# EAGLE design 2DD-20-mk-2.0.0 (EAGLE 7.5.0)
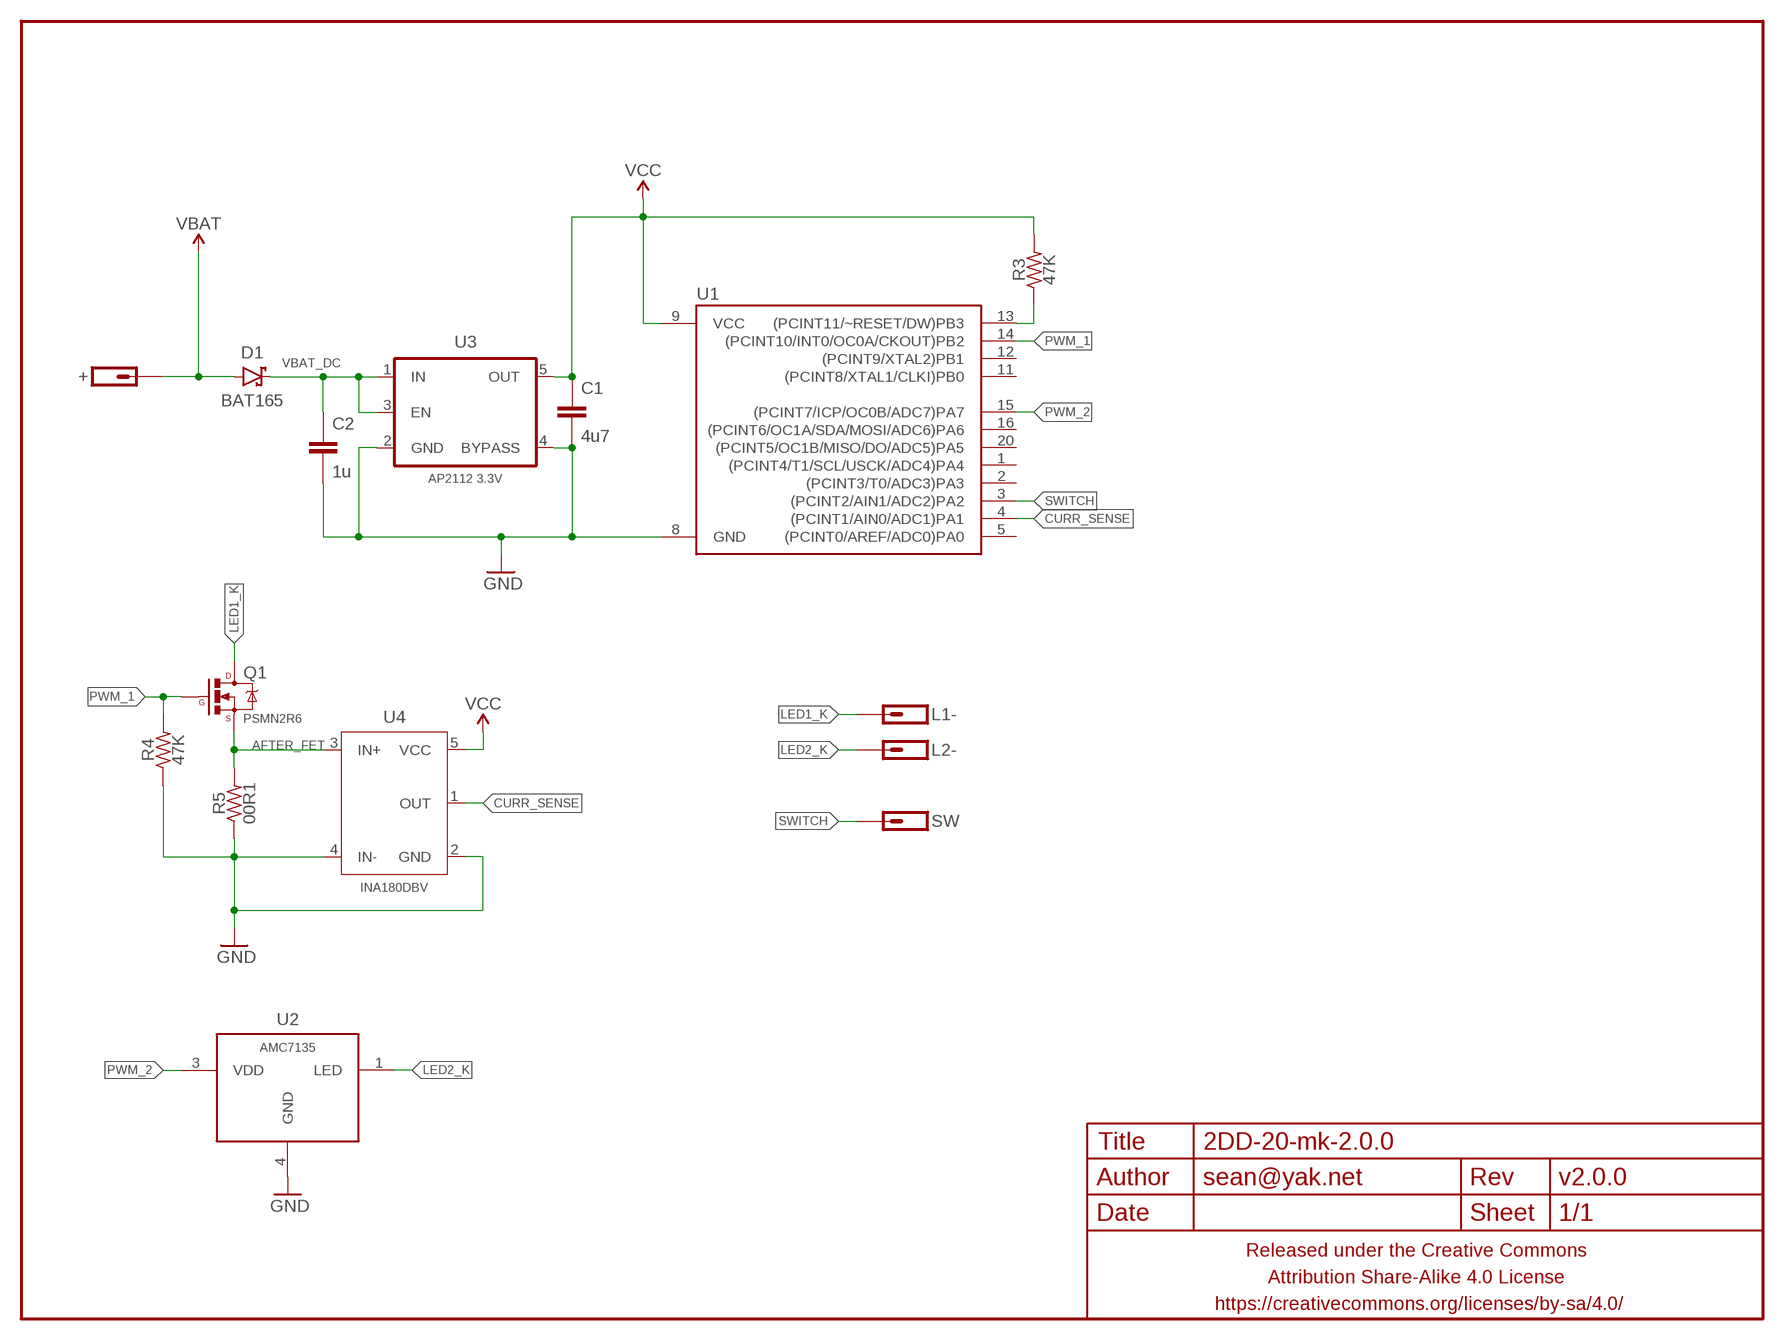
[diagram p0: schematic, sheet 1]

## Parts
+  M01PTH-1MM-CIR-NS  [1X01-1MM-CIR-NS]
C1  4u7  CAPACITOR-CERAMICC0603-TIGHTER  [C0603-TIGHTER]
C2  1u  CAPACITOR-CERAMICC0402  [C0402]
D1  BAT165  DIODE-SCHOTTKYSOD323  [SOD323-SCHOTTKY]
FRAME1  FRAME-LETTERNO_PACKAGE  [DUMMY]
L1-  M011X01-0.9MM-CIR  [1X01-0.9MM-CIR]
L2-  M01PTH-0.8MM-CIR  [1X01-0.8MM-CIR]
Q1  PSMN2R6  MOSFET-NCHANNELSIR800DP  [POWERPACK-SO-8]
R3  47K  RESISTORR0402  [R0402]
R4  47K  RESISTORR0402  [R0402]
R5  00R1  RESISTORR1206  [R1206]
SW  M01SMD-0.8MM-DIA-NS  [1X01-SMD-0.8MM-DIA-NS]
U1  ATTINY84ATTINY84-20MU  [QFN20]
U2  AMC7135  AMC7135SOT-89-NOTHERM-ROUNDED-LESS  [SOT89-NOTHERM-ROUNDED-LESS]
U3  AP2112 3.3V  V_REG_SOT-23-5AP2112  [SOT23-5]
U4  INA180DBV  [SOT23-5]

## Nets
AFTER_FET: Q1.1(S) Q1.2(S) Q1.3(S) R5.2 U4.3(IN+)
CURR_SENSE: U1.4((PCINT1/AIN0/ADC1)PA1) U4.1(OUT)
GND: C1.2 C2.2 R4.1 R5.1 U1.8(GND) U2.4(GND) U3.2(GND) U3.4(BYPASS) U4.2(GND) U4.4(IN-)
LED1_K: L1-.P$1 Q1.5678(D)
LED2_K: L2-.1 U2.1(LED)
N$1: R3.1 U1.13((PCINT11/~RESET/DW)PB3)
PWM_1: Q1.4(G) R4.2 U1.14((PCINT10/INT0/OC0A/CKOUT)PB2)
PWM_2: U1.15((PCINT7/ICP/OC0B/ADC7)PA7) U2.3(VDD)
SWITCH: SW.P$1 U1.3((PCINT2/AIN1/ADC2)PA2)
VBAT: +.1 D1.A
VBAT_DC: C2.1 D1.C U3.1(IN) U3.3(EN)
VCC: C1.1 R3.2 U1.9(VCC) U3.5(OUT) U4.5(VCC)
Unconnected: U1.1((PCINT4/T1/SCL/USCK/ADC4)PA4) U1.2((PCINT3/T0/ADC3)PA3) U1.5((PCINT0/AREF/ADC0)PA0) U1.11((PCINT8/XTAL1/CLKI)PB0) U1.12((PCINT9/XTAL2)PB1) U1.16((PCINT6/OC1A/SDA/MOSI/ADC6)PA6) U1.20((PCINT5/OC1B/MISO/DO/ADC5)PA5)

## Library data of the parts
+ L1- L2- SW = a_parts:M01: Header 1 Standard 1-pin 0.1" header. Use with straight break away headers (SKU : PRT-00116), right angle break away headers (PRT-00553), swiss pins (PRT-00743), machine pins (PRT-00117), and female headers (PRT-00115).
C1 C2 = a_parts:CAPACITOR-CERAMIC: CAPACITOR, European symbol
D1 = a_parts:DIODE-SCHOTTKY: Schottky diodes in SFE's production catalog BAT20J 1A 23V 0.62Vf RB751 120mA 40V 0.37Vf PMEG4005EJ 0.5A 40V 0.42Vf MBRA140 1A 40V 0.5Vf B340A 3A 40V SMA
FRAME1 = a_parts:FRAME-LETTER: Schematic Frame Standard 8.5x11 US Letter frame; DESIGNER: sean@yak.net; VERSION: v2.0.0
Q1 = a_parts:MOSFET-NCHANNEL: Common NMOSFET Parts MFG P/N Store ID Prod ID FDD8780 TRANS-09984 SI7820DN TRANS-11055 FDS6630A IC-08089 2N7002PW TRANS-11151 FQP30N06L COM-10213 TRANS-10060 BSS123LT1G TRANS-08345 BSS138 TRANS-00830 BS170 2N7000
R3-R5 = a_parts:RESISTOR: RESISTOR, American symbol
U1 = a_parts:ATTINY84: Atmel 14-pin 2/4/8kB flash uC
U2 = a_parts:AMC7135
U3 = a_parts:V_REG_SOT-23-5
U4 = a_parts:INA180

## Board
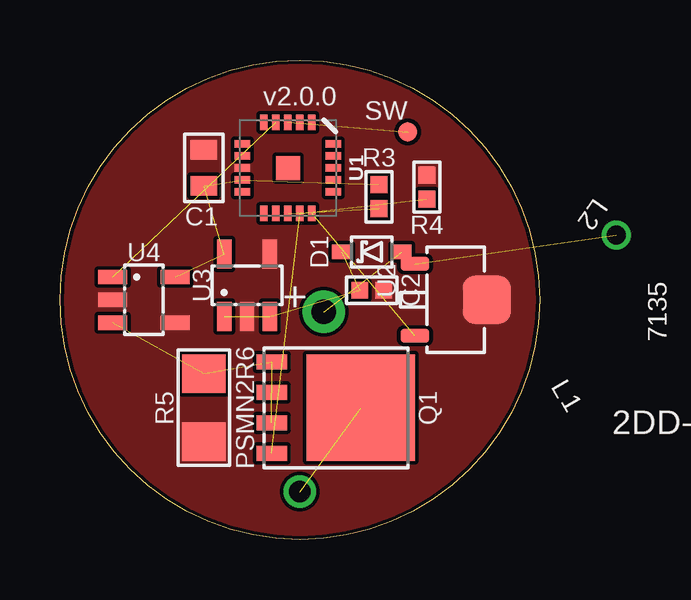
[diagram p1: board, top side]
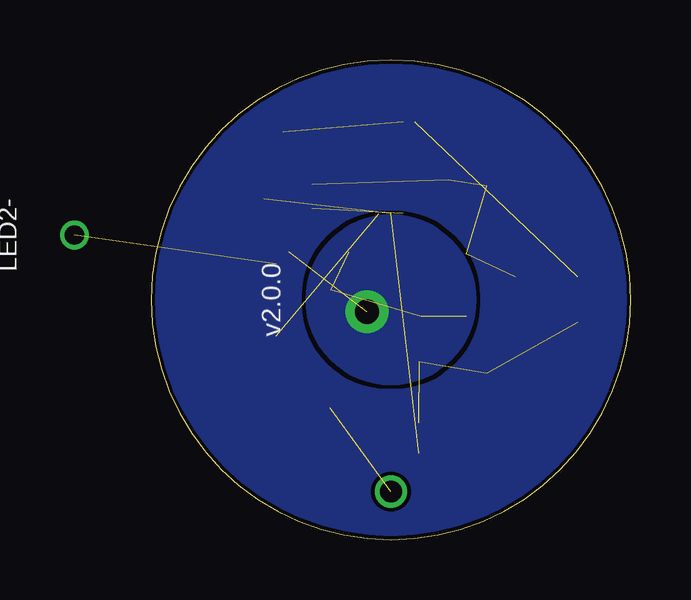
[diagram p2: board, bottom side, seen from below]

Size 20 x 20 mm. Coordinates in mm from the lower left corner, seen from the top.
Outline: 0,10 arc-180 20,10 arc-180 0,10
Copper layers (1*16): Top 0.0356mm / dielectric 1.5011mm / Bottom 0.0356mm
Design rules "LaenPCBOrder2": minimum track width 6mil, minimum drill 13mil, track to track 6mil, track to pad 6mil, pad to pad 6mil, via to via 6mil, smd to smd 6mil, copper to edge 6mil, drill to drill 6mil, minimum pad ring 7mil, minimum via ring 7mil, stop-mask expansion 3mil, vias tented up to drill 20mil, thermal gap 10mil

### Footprints (pad centres in the part's own frame; a part is rotated, then mirrored left to right if it is on the bottom)
1X01-1MM-CIR-NS = drill 1.016 pad 1.778: 1 0,0
C0603-TIGHTER = smd 0.8 x 1.1: 1 -0.75,0; 2 0.75,0
C0402 = smd 0.7 x 0.7: 1 -0.5,0; 2 0.5,0
SOD323-SCHOTTKY = smd 0.8 x 0.6: A -1.25,0; C 1.25,0
1X01-0.9MM-CIR = drill 0.9 pad 1.3: P$1 0,0
1X01-0.8MM-CIR = drill 0.8: 1 0,0
POWERPACK-SO-8 = smd 1.27 x 0.61: 1 -2.67,1.905; 2 -2.67,0.635; 3 -2.67,-0.635; 4 -2.67,-1.905 | smd 4.52 x 4.42: 5678 1.045,0
R0402 = smd 0.7 x 0.7: 1 -0.5,0; 2 0.5,0
R1206 = smd 1.6 x 1.8: 1 -1.42,0; 2 1.42,0
1X01-SMD-0.8MM-DIA-NS = smd 0.8 x 0.8: P$1 0,0
QFN20 = smd 1 x 1: 0 0,0 | smd 0.65 x 0.3: 1 -1.9,1; 2 -1.9,0.5; 3 -1.9,0; 4 -1.9,-0.5; 5 -1.9,-1; 11 1.9,-1; 12 1.9,-0.5; 13 1.9,0; 14 1.9,0.5; 15 1.9,1 | smd 0.3 x 0.65: 6 -1,-1.9; 7 -0.5,-1.9; 8 0,-1.9; 9 0.5,-1.9; 10 1,-1.9; 16 1,1.9; 17 0.5,1.9; 18 0,1.9; 19 -0.5,1.9; 20 -1,1.9
SOT89-NOTHERM-ROUNDED-LESS = smd 0.58 x 1.2: 1 -1.5,-1.7; 3 1.5,-1.7 | smd 2 x 2: 4 0,1.3
SOT23-5 = smd 0.6 x 1.2: 1 -0.95,-1.3; 2 0,-1.3; 3 0.95,-1.3; 4 0.95,1.3; 5 -0.95,1.3

### Placement (x,y rotation side)
+  11,9.5 90 top
C1  6,15.5 90 top
C2  13,10.4 0 top
D1  13,12 180 top
FRAME1  0,0 0 top
L1-  10,2 270 top
L2-  23.2,12.7 90 top  (outside the outline)
Q1  11.5,5.5 0 top
R3  13.3,14.3 90 top
R4  15.3,14.7 270 top
R5  6,5.5 90 top
SW  14.5,17 0 top
U1  9.5,15.5 270 top
U2  16.5,10 270 top
U3  7.8,10.6 0 top
U4  3.5,10 270 top

### Tracks (layer width: path | path; a pad name or v marks a point on that pad's centre or on a via)
AFTER_FET  (4 unrouted)
CURR_SENSE  (1 unrouted)
GND
  pour Top (isolate 0.152, rank 6, no thermals): 0,10 arc90 10,0 arc90 20,10 arc90 10,20 arc90
  pour Bottom (isolate 0.152, rank 6, no thermals): 20,10 arc-90 10,0 arc-90 0,10 arc-90 10,20 arc-90
LED1_K  (1 unrouted)
LED2_K  (1 unrouted)
N$1  (1 unrouted)
PWM_1  (2 unrouted)
PWM_2  (1 unrouted)
SWITCH  (1 unrouted)
VBAT  (1 unrouted)
  pour Bottom (isolate 0.152, no thermals): 6.5,10 arc-180 13.5,10 arc-180
VBAT_DC  (3 unrouted)
VCC  (4 unrouted)

### Text on the board
tPlace: AP2112 | 7135 | INA180 | 2DD-20
bPlace: LED2- | 2DD-20 | LED1-
tNames: L2 | L | 1